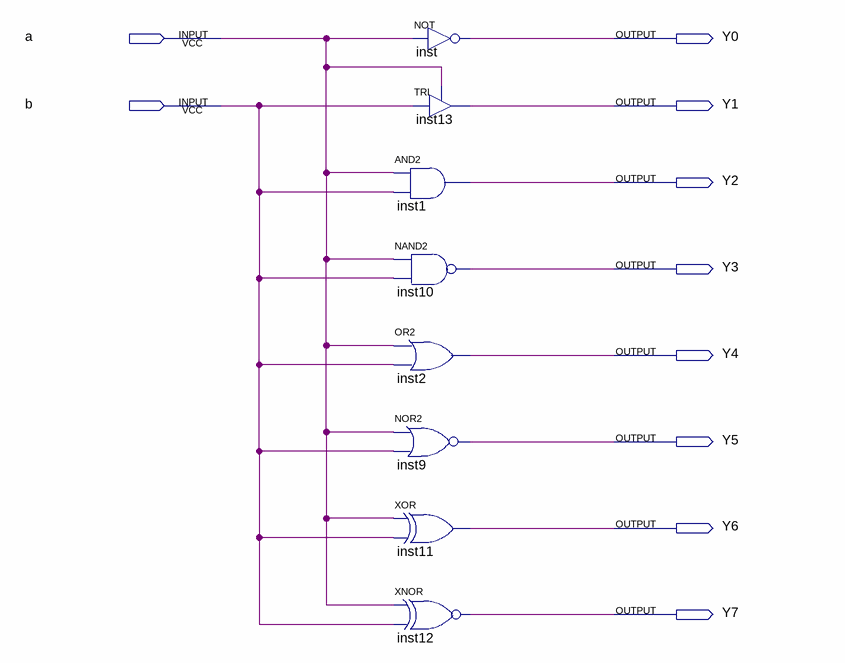
[diagram p0: schematic sheet]
// Quartus schematic Block1.bdf as structural Verilog: 8 symbols, 10 pins
module Block1 (
  input  a,
  input  b,
  output Y0,
  output Y1,
  output Y2,
  output Y3,
  output Y4,
  output Y5,
  output Y6,
  output Y7
);

  and inst1 (Y2, a, b);
  nand inst10 (Y3, a, b);
  or inst2 (Y4, a, b);
  nor inst9 (Y5, a, b);
  xor inst11 (Y6, a, b);
  xnor inst12 (Y7, a, b);
  not inst (Y0, a);
  TRI inst13 (.IN(b), .OE(a), .OUT(Y1));
endmodule
